# Altium schematic sheet HDMI.schdoc: =
size A4; Symbol: Sheet-Symbol_A4; Company: 嘉立创EDA; Version: V1.0; Page Size: A4; @Project Name: RK3568B2地瓜派; @Page Count: 26; @Update Date: 2025-09-11; @Create Date: 2025-09-11; @Schematic Name: Schematic1; @Page No: 19; @Page Name: HDMI; Device: Sheet-Symbol_A4; Border: 1; Title Block Position: 3; Width: 1170; Height: 825; Region Start: 1; X Region Count: 6; Y Region Count: 4; Blade Width: 10; @Board Name: Board1; @Create Time: 22:18:09; @Update Time: 22:18:53; Organization: ORGANIZATION; Address1: ADDRESS 1; Address2: ADDRESS 2; Address3: ADDRESS 3; Address4: ADDRESS 4; SheetNumber: 21; SheetTotal: 28
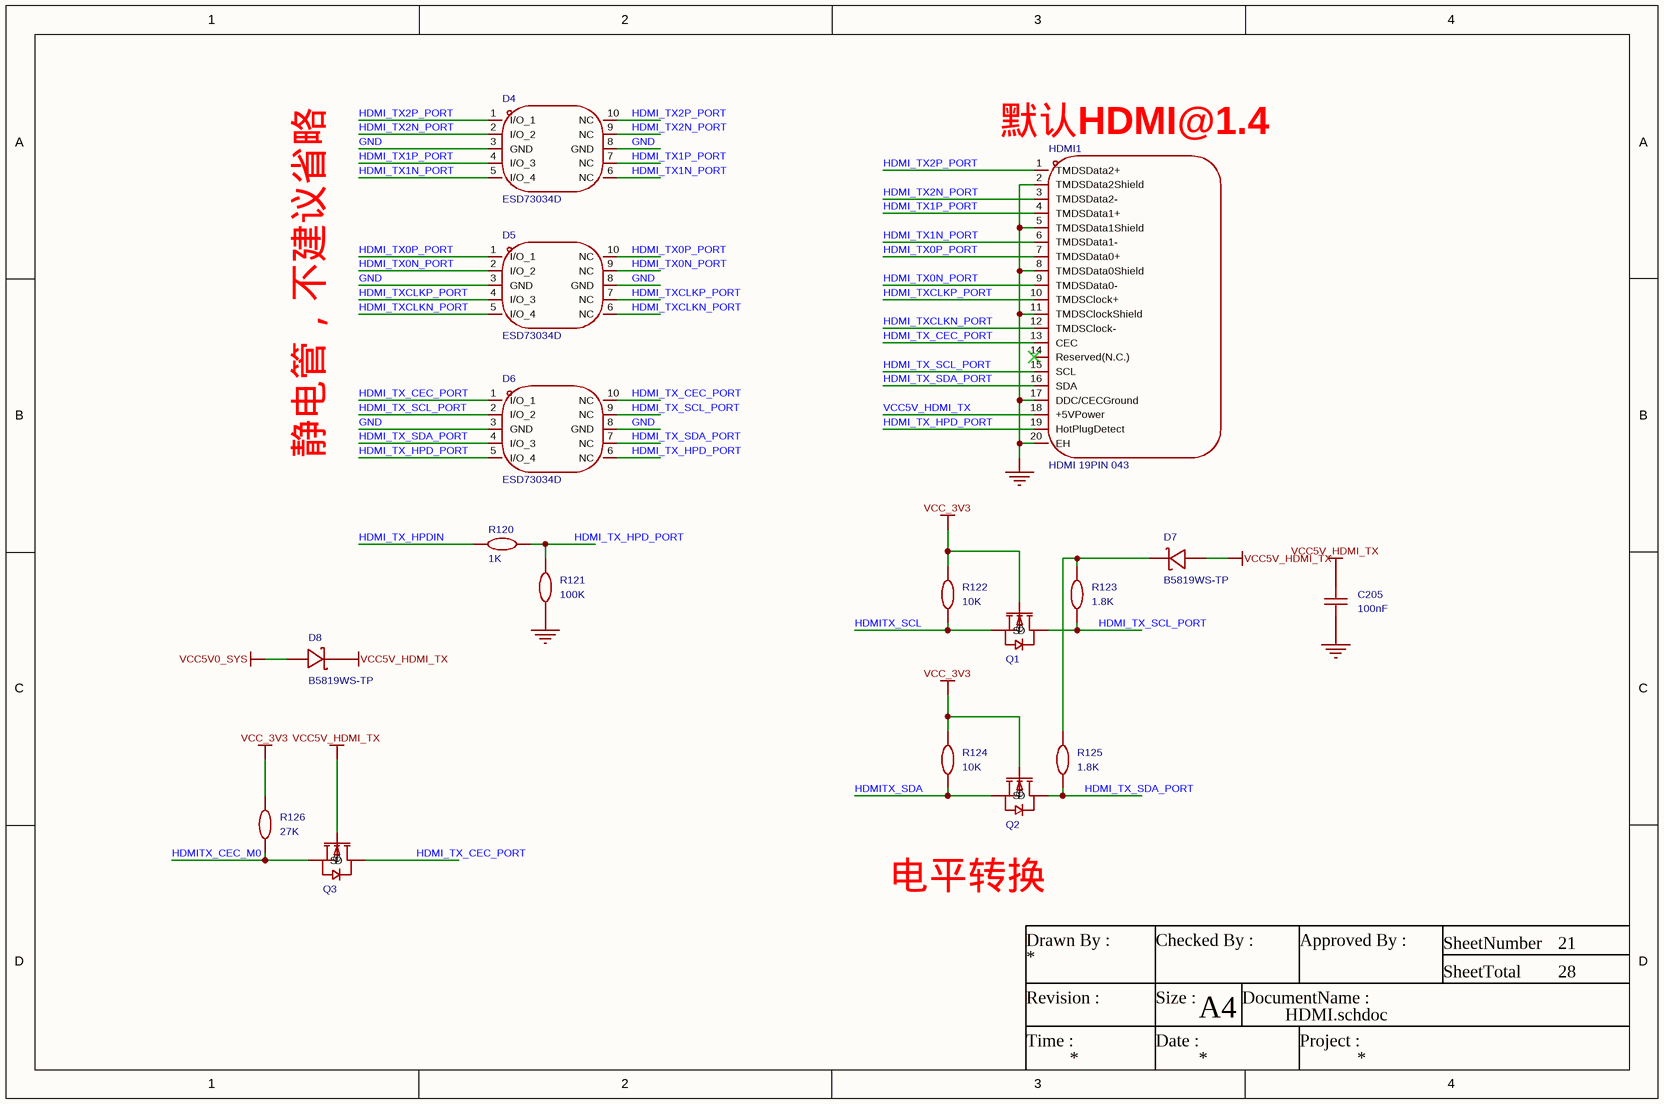
[diagram p0: HDMI.schdoc]

## Parts
C205  100nF  [C0603]
D4  ESD73034D  [DFN-10_L2.5-W1.0-P0.50-BL-2]
D5  ESD73034D  [DFN-10_L2.5-W1.0-P0.50-BL-2]
D6  ESD73034D  [DFN-10_L2.5-W1.0-P0.50-BL-2]
D7  B5819WS-TP  [SOD-323_L1.8-W1.3-LS2.5-RD]
D8  B5819WS-TP  [SOD-323_L1.8-W1.3-LS2.5-RD]
HDMI1  HDMI 19PIN 043  [HDMI-SMD_HDMI-19PIN-043]
Q1  (no value)  [SOT-23-3_L2.9-W1.3-P1.90-LS2.4-BR]
Q2  (no value)  [SOT-23-3_L2.9-W1.3-P1.90-LS2.4-BR]
Q3  (no value)  [SOT-23-3_L2.9-W1.3-P1.90-LS2.4-BR]
R120  1K  [R0402]
R121  100K  [R0402]
R122  10K  [R0402]
R123  1.8K  [R0402]
R124  10K  [R0402]
R125  1.8K  [R0402]
R126  27K  [R0402]

## Nets
GND: C205.1 D4.3(GND) D4.8(GND) D5.3(GND) D5.8(GND) D6.3(GND) D6.8(GND) HDMI1.2(TMDSData2Shield) HDMI1.5(TMDSData1Shield) HDMI1.8(TMDSData0Shield) HDMI1.11(TMDSClockShield) HDMI1.17(DDC/CECGround) HDMI1.20(EH) R121.1
VCC5V0_SYS: D8.2(A)
VCC5V_HDMI_TX: C205.2 D7.2(A) D8.1(K) HDMI1.18(+5VPower) Q3.1(G)
VCC_3V3: Q1.1(G) Q2.1(G) R122.2 R124.2 R126.2
HDMI_TX0N_PORT: D5.2(I/O_2) D5.9(NC) HDMI1.9(TMDSData0-)
HDMI_TX0P_PORT: D5.1(I/O_1) D5.10(NC) HDMI1.7(TMDSData0+)
HDMI_TX1N_PORT: D4.5(I/O_4) D4.6(NC) HDMI1.6(TMDSData1-)
HDMI_TX1P_PORT: D4.4(I/O_3) D4.7(NC) HDMI1.4(TMDSData1+)
HDMI_TX2N_PORT: D4.2(I/O_2) D4.9(NC) HDMI1.3(TMDSData2-)
HDMI_TX2P_PORT: D4.1(I/O_1) D4.10(NC) HDMI1.1(TMDSData2+)
HDMI_TX_CEC_PORT: D6.1(I/O_1) D6.10(NC) HDMI1.13(CEC) Q3.3(D)
HDMI_TX_HPD_PORT: D6.5(I/O_4) D6.6(NC) HDMI1.19(HotPlugDetect) R120.2 R121.2
HDMI_TX_HPDIN: R120.1
HDMI_TX_SCL_PORT: D6.2(I/O_2) D6.9(NC) HDMI1.15(SCL) Q1.3(D) R123.1
HDMI_TX_SDA_PORT: D6.4(I/O_3) D6.7(NC) HDMI1.16(SDA) Q2.3(D) R125.1
HDMI_TXCLKN_PORT: D5.5(I/O_4) D5.6(NC) HDMI1.12(TMDSClock-)
HDMI_TXCLKP_PORT: D5.4(I/O_3) D5.7(NC) HDMI1.10(TMDSClock+)
HDMITX_CEC_M0: Q3.2(S) R126.1
HDMITX_SCL: Q1.2(S) R122.1
HDMITX_SDA: Q2.2(S) R124.1
NetD7_1: D7.1(K) R123.2 R125.2

Not connected (* = marked no-connect by the designer): HDMI1 14(Reserved(N.C.))*

## Notes on the sheet
- 静电管，不建议省略
- (near HDMI1) 默认HDMI@1.4
- 电平转换
- Drawn By :
- Checked By :
- Approved By :
- SheetNumber
- SheetTotal
- Revision :
- Time :
- Size :
- Date :
- A4
- DocumentName :
- Project :

## Library data of the parts
C205 = CAP_0603: ConvertToPcb: yes; SymbolName: Capacitance; ModelId: ac125912035d415993ca9572d50418b1; ModelName: C0603_L1.6-W0.8-H0.8; ModelTransform: 62.992,31.496,0,0,0,0,0,0,0; Device: CAP_0603; AddInBom: yes; Supplier Footprint: 0603; FootprintName: C0603; Value: 100nF
D4-D6 = ESD73034D: 极性:双向;反向截止电压(Vrwm):3.3V;钳位电压:18V;峰值脉冲电流(Ipp):3A@8/20us;峰值脉冲功率(Ppp):60W@8/20us;击穿电压:8.5V;; Manufacturer: TECH PUBLIC(台舟); AddInBom: yes; ModelId: bdfd66bff1204c318d65223fd39cc645; ModelTransform: 40.1574,98.8187,0,90,0,0,0,0,0; Polarity: 双向; Reverse Stand-Off Voltage (Vrwm): 3.3V; Clamping Voltage: 18V; Voltage - Breakdown: 8.5V; Reverse Leakage Current (Ir): 200nA; Number of Channels: 四路; level of protection: IEC 61000-4-5；IEC 61000-4-2; Type: ESD; Junction Capacitance: 0.25pF; Symbol: ESD73034D; Device: ESD73034D; LCSC Part Name: ESD73034D-10/TR; SupplierPart: C7202962; ManufacturerPart: ESD73034D; Supplier Footprint: DFN2510-10; JLCPCB Part Class: 扩展库; Datasheet: https://item.szlcsc.com/datasheet/ESD73034D/8170920.html; Supplier: LCSC; ConvertToPcb: yes; FootprintName: DFN-10_L2.5-W1.0-P0.50-BL-2; ModelName: DFN-10_L2.5-W1.0-P0.50-BL-2; Peak Pulse Current (Ipp): 3A@8/20us; Peak Pulse Power Dissipation (Ppp): 60W@8/20us
D7 D8 = B5819WS-TP: 正向压降(Vf):600mV@1A;直流反向耐压(Vr):40V;平均整流电流(Io):1A;; Manufacturer: MCC(美微科); AddInBom: yes; ModelId: 7459fe65e23146c0a8d836e46a0add72; ModelTransform: 104.3305,51.181,0,0,0,0,0,0,0; Reverse Voltage (Vr): 40V; Average Rectified Current (Io): 1A; Reverse Leakage Current (Ir): 1mA@40V; Symbol: B5819WS-TP; Device: B5819WS-TP; LCSC Part Name: 电压:40V 电流:1A; SupplierPart: C78734; ManufacturerPart: B5819WS-TP; Supplier Footprint: SOD-323; JLCPCB Part Class: 扩展库; Datasheet: https://atta.szlcsc.com/upload/public/pdf/source/20190308/C78734_7BD7F562D63F05C7B4187010ADA330AA.pdf; Supplier: LCSC; ConvertToPcb: yes; FootprintName: SOD-323_L1.8-W1.3-LS2.5-RD; ModelName: SOD-323_L1.8-W1.3-LS2.5-RD; Forward Voltage (Vf@If): 600mV@1A
HDMI1 = HDMI 19PIN 043: USB母座/HD-MI 19PIN母座 4脚插件 贴片19PIN 铁壳镀镍; Manufacturer: SHOU HAN(首韩); AddInBom: yes; ModelId: c61f66854239499383675c08a93d807c; ModelName: HDMI-SMD_HDMI-9PIN-043; ModelTransform: 590.55,474.4085,0,0,0,0,0,-71.654,-78.74; Connector Type: HDMI-A; Gender: 母; Current Rating (Max): 300mA; Rated Voltage (Max): 40V; Symbol: HDMI 19PIN 043; Device: HDMI 19PIN 043; LCSC Part Name: HDMI 19PIN 043; SupplierPart: C2858275; ManufacturerPart: HDMI 19PIN 043; Supplier Footprint: SMD; JLCPCB Part Class: 扩展库; Datasheet: https://atta.szlcsc.com/upload/public/pdf/source/20210728/C2858275_DF299413048A9CF092C2A61AB97004F4.pdf; Supplier: LCSC; ConvertToPcb: yes; FootprintName: HDMI-SMD_HDMI-19PIN-043; Number of Pins: 19P; Mounting Style: 卧贴; Operating Temperature Range: -55℃~+85℃
Q1-Q3 = AO3400A_N: 类型:N沟道;漏源电压(Vdss):30V;连续漏极电流(Id):5.2A;功率(Pd):1W;导通电阻(RDS(on)@Vgs,Id):35mΩ@10V,5A;阈值电压(Vgs(th)@Id):1.5V@250μA;; Symbol: N_MOS; AddInBom: yes; ModelId: c62791f0466c4ae2a892c056b845b0ca; ModelName: SOT-23-3P_L2.9-W1.3-H1.0-LS2.4-P0.95; ModelTransform: 98.425,114.173,0,180,0,0,0.0005,-0.0005,0; Device: AO3400A_N; Supplier Footprint: SOT-23; ConvertToPcb: yes; FootprintName: SOT-23-3_L2.9-W1.3-P1.90-LS2.4-BR; SupplierPart: C700953
R120-R126 = Res_0402: Symbol: 电阻; 3D Model: 671aefced39d4c318694bba8bd8efd39; 3D Model Transform: 39.37,19.685,0,0,0,0,0,0.0005,0; ConvertToPcb: yes; ModelName: R0402_L1.0-W0.5-H0.5; Device: Res_0402; AddInBom: yes; Supplier Footprint: 0402; FootprintName: R0402
  R120: Value: 1K
  R121: Value: 100K
  R122 R124: Value: 10K
  R123 R125: Value: 1.8K
  R126: Value: 27K